# EAGLE design untitled (EAGLE 9.6.2)
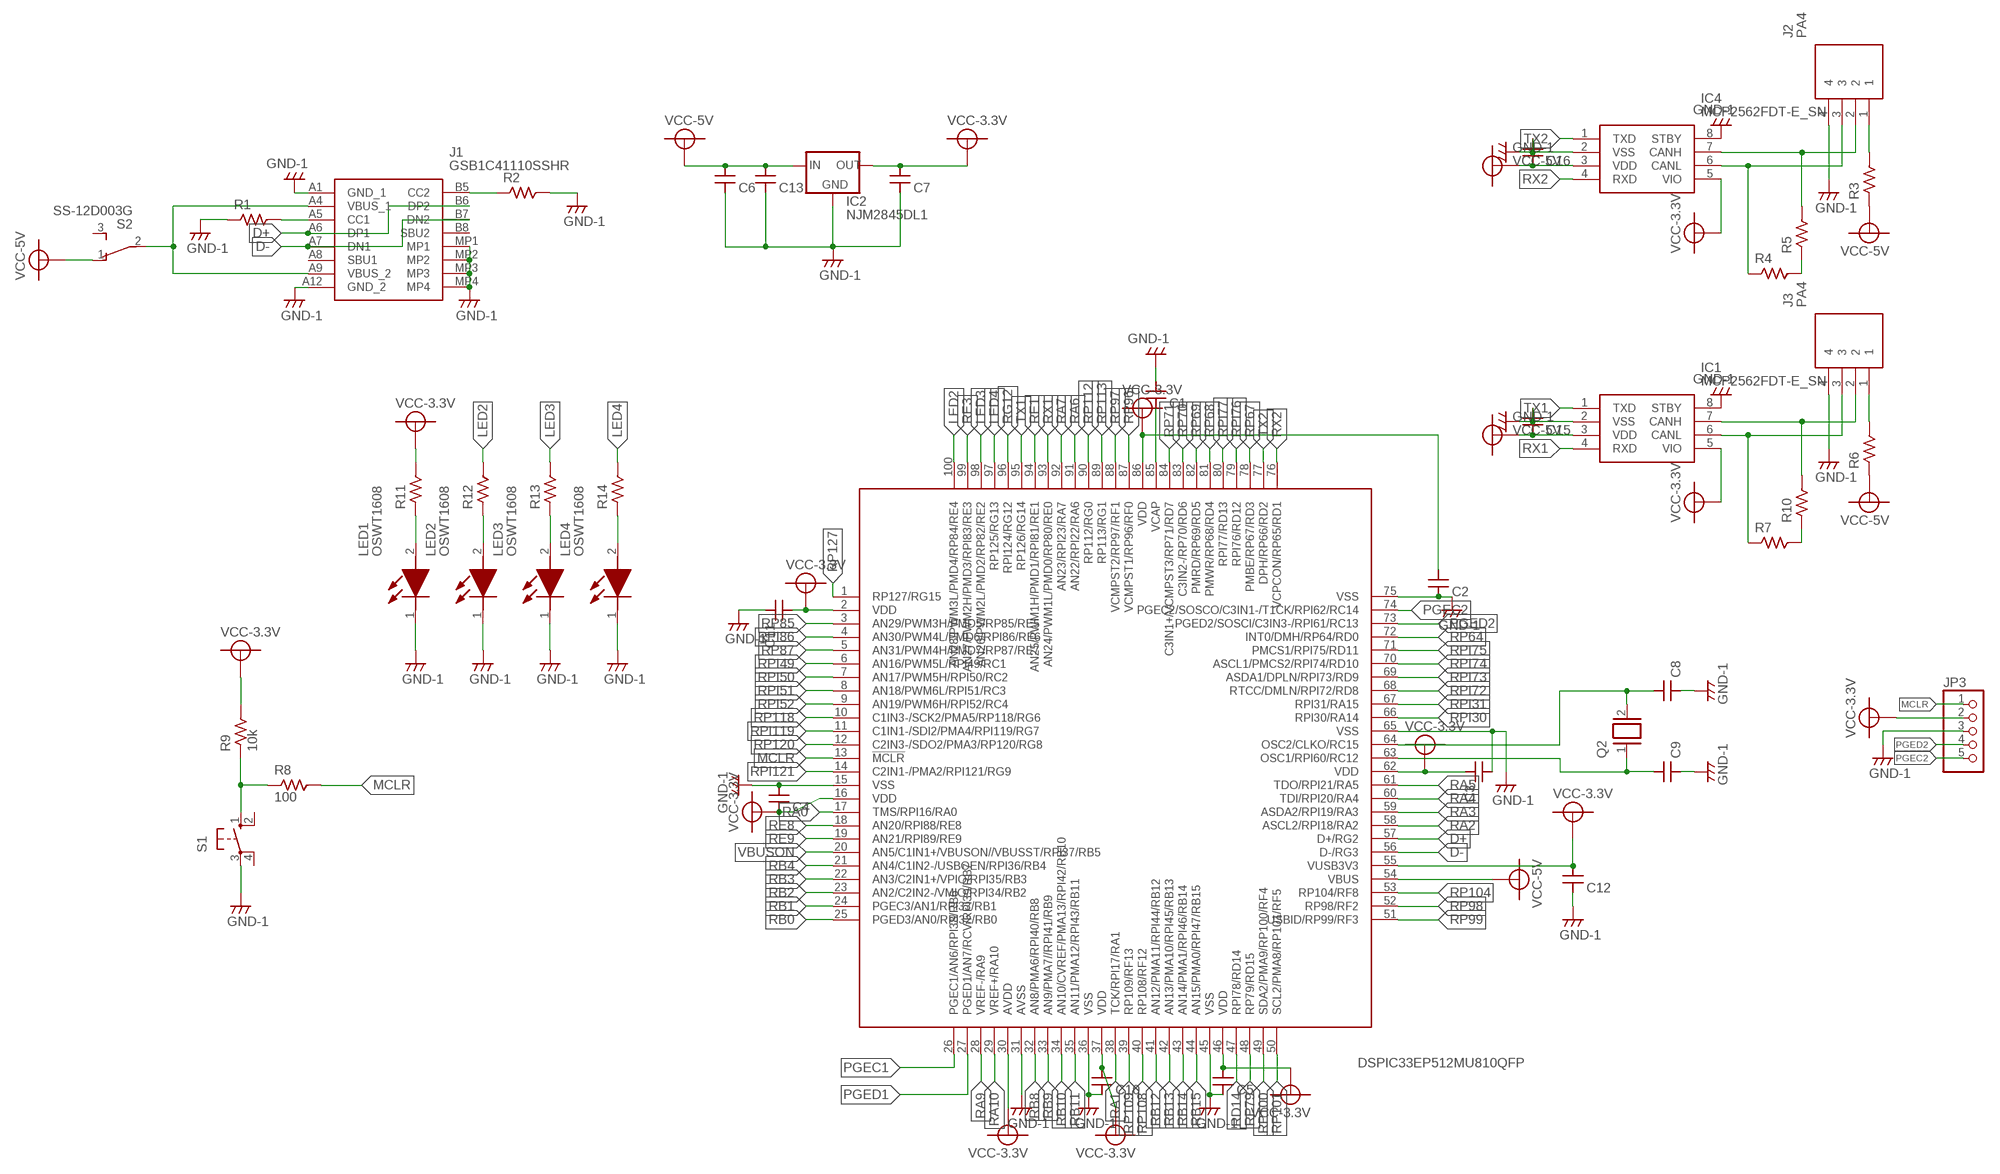
[diagram p0: schematic, sheet 1]

## Parts
C1  CC1068  [C1608]
C2  CC1068  [C1608]
C3  CC1068  [C1608]
C4  CC1068  [C1608]
C5  CC1068  [C1608]
C6  CC3216  [C3216]
C7  CC3216  [C3216]
C8  CC2.54  [C:1]
C9  CC2.54  [C:1]
C10  CC1068  [C1608]
C11  CC1068  [C1608]
C12  CC1068  [C1608]
C13  CC1068  [C1608]
C15  CC1068  [C1608]
C16  CC1068  [C1608]
IC1  MCP2562FDT-E_SN  [SOIC127P600X175-8N]
IC2  NJM2845DL1  [TO252]
IC3  DSPIC33EP512MU810QFP  [TQFP100_0.5]
IC4  MCP2562FDT-E_SN  [SOIC127P600X175-8N]
J1  GSB1C41110SSHR  [GSB1C41110SSHR]
J2  PA4  [PA4]
J3  PA4  [PA4]
JP3  PINHD-1X5/90  [1X05/90]
LED1  OSWT1608  [LEDC1608X70N]
LED2  OSWT1608  [LEDC1608X70N]
LED3  OSWT1608  [LEDC1608X70N]
LED4  OSWT1608  [LEDC1608X70N]
Q2  XTAL/S  [QS]
R1  R1/10W  [C1608]
R2  R1/10W  [C1608]
R3  R1/10W  [C1608]
R4  R1/10W  [C1608]
R5  R1/10W  [C1608]
R6  R1/10W  [C1608]
R7  R1/10W  [C1608]
R8  100  R1/10W  [C1608]
R9  10k  R1/10W  [C1608]
R10  R1/10W  [C1608]
R11  R1/10W  [C1608]
R12  R1/10W  [C1608]
R13  R1/10W  [C1608]
R14  R1/10W  [C1608]
S1  10-XX  [B3F-10XX]
S2  SS-12D003G  [SS-12D003G]

## Nets
+3.3V: C2.1 C3.2 C4.2 C5.1 C7.1 C10.1 C11.1 C12.1 IC1.5(VIO) IC2.3(OUT) IC3.2(VDD) IC3.16(VDD) IC3.30(AVDD) IC3.37(VDD) IC3.46(VDD) IC3.55(VUSB3V3) IC3.62(VDD) IC3.86(VDD) IC4.5(VIO) JP3.2 R9.2 R11.2 ; supply symbol labelled VCC-3.3V
+5V: C6.1 C13.1 C15.2 C16.2 IC1.3(VDD) IC2.1(IN) IC3.54(VBUS) IC4.3(VDD) R3.1 R6.1 S2.1(O) ; supply symbol labelled VCC-5V
D+: IC3.57(D+/RG2) J1.A6(DP1) J1.B6(DP2)
D-: IC3.56(D-/RG3) J1.A7(DN1) J1.B7(DN2)
GND: C1.1 C2.2 C3.1 C4.1 C5.2 C6.2 C7.2 C8.P$2 C9.P$2 C10.2 C11.2 C12.2 C13.2 C15.1 C16.1 IC1.2(VSS) IC1.8(STBY) IC2.2(GND) IC3.15(VSS) IC3.31(AVSS) IC3.36(VSS) IC3.45(VSS) IC3.65(VSS) IC3.75(VSS) IC4.2(VSS) IC4.8(STBY) J1.A1(GND_1) J1.A12(GND_2) J1.MP1 J1.MP2 J1.MP3 J1.MP4 J2.4 J3.4 JP3.3 LED1.1(K) LED2.1(K) LED3.1(K) LED4.1(K) R1.1 R2.2 S1.3(P) ; supply symbol labelled GND-1
LED2: IC3.100(AN28/PWM3L/PMD4/RP84/RE4) R12.2
LED3: IC3.98(AN26/PWM2L/PMD2/RP82/RE2) R13.2
LED4: IC3.97(RP125/RG13) R14.2
MCLR: IC3.13(!MCLR) JP3.1 R8.2
N$1: C9.P$1 IC3.63(OSC1/RPI60/RC12) Q2.1
N$2: C8.P$1 IC3.64(OSC2/CLKO/RC15) Q2.2
N$3: IC4.7(CANH) J2.2 R5.2
N$4: IC4.6(CANL) J2.3 R4.1
N$5: C1.2 IC3.85(VCAP)
N$6: J2.1 R3.2
N$7: R4.2 R5.1
N$8: J1.B5(CC2) R2.1
N$9: J1.A5(CC1) R1.2
N$10: R8.1 R9.1 S1.1(S)
N$11: J1.A4(VBUS_1) J1.A9(VBUS_2) S2.2(P)
N$12: IC1.7(CANH) J3.2 R10.2
N$13: IC1.6(CANL) J3.3 R7.1
N$14: J3.1 R6.2
N$15: R7.2 R10.1
N$16: LED1.2(A) R11.1
N$17: LED2.2(A) R12.1
N$18: LED3.2(A) R13.1
N$19: LED4.2(A) R14.1
PGEC1: IC3.26(PGEC1/AN6/RPI38/RB6)
PGEC2: IC3.74(PGEC2/SOSCO/C3IN1-/T1CK/RPI62/RC14) JP3.5
PGED1: IC3.27(PGED1/AN7/RCV/RPI39/RB7)
PGED2: IC3.73(PGED2/SOSCI/C3IN3-/RPI61/RC13) JP3.4
RA0: IC3.17(TMS/RPI16/RA0)
RA1: IC3.38(TCK/RPI17/RA1)
RA2: IC3.58(ASCL2/RPI18/RA2)
RA3: IC3.59(ASDA2/RPI19/RA3)
RA4: IC3.60(TDI/RPI20/RA4)
RA5: IC3.61(TDO/RPI21/RA5)
RA6: IC3.91(AN22/RPI22/RA6)
RA7: IC3.92(AN23/RPI23/RA7)
RA9: IC3.28(VREF-/RA9)
RA10: IC3.29(VREF+/RA10)
RB0: IC3.25(PGED3/AN0/RPI32/RB0)
RB1: IC3.24(PGEC3/AN1/RPI33/RB1)
RB2: IC3.23(AN2/C2IN2-/VMIO/RPI34/RB2)
RB3: IC3.22(AN3/C2IN1+/VPIO/RPI35/RB3)
RB4: IC3.21(AN4/C1IN2-/USBOEN/RPI36/RB4)
RB8: IC3.32(AN8/PMA6/RPI40/RB8)
RB9: IC3.33(AN9/PMA7//RPI41/RB9)
RB10: IC3.34(AN10/CVREF/PMA13/RPI42/RB10)
RB11: IC3.35(AN11/PMA12/RPI43/RB11)
RB12: IC3.41(AN12/PMA11/RPI44/RB12)
RB13: IC3.42(AN13/PMA10/RPI45/RB13)
RB14: IC3.43(AN14/PMA1/RPI46/RB14)
RB15: IC3.44(AN15/PMA0/RPI47/RB15)
RD14: IC3.47(RPI78/RD14)
RE1: IC3.94(AN25/PWM1H/PMD1/RPI81/RE1)
RE3: IC3.99(AN27/PWM2H/PMD3/RPI83/RE3)
RE8: IC3.18(AN20/RPI88/RE8)
RE9: IC3.19(AN21/RPI89/RE9)
RG12: IC3.96(RPI124/RG12)
RP64: IC3.72(INT0/DMH/RP64/RD0)
RP67: IC3.78(PMBE/RP67/RD3)
RP68: IC3.81(PMWR/RP68/RD4)
RP69: IC3.82(PMRD/RP69/RD5)
RP70: IC3.83(C3IN2-/RP70/RD6)
RP71: IC3.84(C3IN1+/VCMPST3/RP71/RD7)
RP79: IC3.48(RP79/RD15)
RP85: IC3.3(AN29/PWM3H/PMD5/RP85/RE5)
RP87: IC3.5(AN31/PWM4H/PMD7/RP87/RE7)
RP96: IC3.87(VCMPST1/RP96/RF0)
RP97: IC3.88(VCMPST2/RP97/RF1)
RP98: IC3.52(RP98/RF2)
RP99: IC3.51(USBID/RP99/RF3)
RP100: IC3.49(SDA2/PMA9/RP100/RF4)
RP101: IC3.50(SCL2/PMA8/RP101/RF5)
RP104: IC3.53(RP104/RF8)
RP108: IC3.40(RP108/RF12)
RP109: IC3.39(RP109/RF13)
RP112: IC3.90(RP112/RG0)
RP113: IC3.89(RP113/RG1)
RP118: IC3.10(C1IN3-/SCK2/PMA5/RP118/RG6)
RP120: IC3.12(C2IN3-/SDO2/PMA3/RP120/RG8)
RP127: IC3.1(RP127/RG15)
RPI30: IC3.66(RPI30/RA14)
RPI31: IC3.67(RPI31/RA15)
RPI49: IC3.6(AN16/PWM5L/RPI49/RC1)
RPI50: IC3.7(AN17/PWM5H/RPI50/RC2)
RPI51: IC3.8(AN18/PWM6L/RPI51/RC3)
RPI52: IC3.9(AN19/PWM6H/RPI52/RC4)
RPI72: IC3.68(RTCC/DMLN/RPI72/RD8)
RPI73: IC3.69(ASDA1/DPLN/RPI73/RD9)
RPI74: IC3.70(ASCL1/PMCS2/RPI74/RD10)
RPI75: IC3.71(PMCS1/RPI75/RD11)
RPI76: IC3.79(RPI76/RD12)
RPI77: IC3.80(RPI77/RD13)
RPI86: IC3.4(AN30/PWM4L/PMD6/RPI86/RE6)
RPI119: IC3.11(C1IN1-/SDI2/PMA4/RPI119/RG7)
RPI121: IC3.14(C2IN1-/PMA2/RPI121/RG9)
RX1: IC1.4(RXD) IC3.93(AN24/PWM1L/PMD0/RP80/RE0)
RX2: IC3.76(VCPCON/RP65/RD1) IC4.4(RXD)
TX1: IC1.1(TXD) IC3.95(RP126/RG14)
TX2: IC3.77(DPH/RP66/RD2) IC4.1(TXD)
VBUSON: IC3.20(AN5/C1IN1+/VBUSON//VBUSST/RPI37/RB5)
Unconnected: J1.A8(SBU1) J1.B8(SBU2) S1.2(S1) S1.4(P1) S2.3(S)

## Library data of the parts
C1-C13 C15 C16 = Robocon-RLC:CC: Ceramic Condensare
IC1 IC4 = MCP2562FDT-E_SN:MCP2562FDT-E_SN: CAN 8Mbps Normal/Standby 3.3V/5V Automotive 8-Pin SOIC N T/R Source: Datasheet <https://ww1.microchip.com/downloads/en/DeviceDoc/20005284A.pdf>; ARROW_PART_NUMBER: MCP2562FDT-E/SN; ARROW_PRICE-STOCK: https://www.arrow.com/en/products/mcp2562fdt-esn/microchip-technology?region=nac; DESCRIPTION: CAN 8Mbps Normal/Standby 3.3V/5V Automotive 8-Pin SOIC N T/R; HEIGHT: 1.75mm; MANUFACTURER_NAME: Microchip; MANUFACTURER_PART_NUMBER: MCP2562FDT-E/SN; MOUSER_PART_NUMBER: 579-MCP2562FDT-E/SN; MOUSER_PRICE-STOCK: https://www.mouser.co.uk/ProductDetail/Microchip-Technology/MCP2562FDT-E-SN?qs=YlpJWyuQ3PNwRkBGVHsNkA%3D%3D
IC2 = Robocon-Regulator:NJM2845DL1
IC3 = Robocon-PICMicroController:DSPIC33EP512MU810
J1 = GSB1C41110SSHR:GSB1C41110SSHR: USB2.0, Type C, Top mount, Center Height 1.63mm, Single Row Surface Mount Source: Datasheet <https://cdn.amphenol-cs.com/media/wysiwyg/files/drawing/gsb1c41x10sshr-ax1.pdf>; DESCRIPTION: USB2.0, Type C, Top mount, Center Height 1.63mm, Single Row Surface Mount; HEIGHT: 3.41mm; MANUFACTURER_NAME: Amphenol Communications Solutions; MANUFACTURER_PART_NUMBER: GSB1C41110SSHR
J2 J3 = Robocon-Connector:PA4: CONN HEADER VERT 4POS 2MM Source: Datasheet <http://www.jst-mfg.com/product/pdf/eng/ePA-F.pdf>; ARROW_PART_NUMBER: B04B-PASK(LF)(SN); ARROW_PRICE-STOCK: https://www.arrow.com/en/products/b04b-pask-lf-sn/jst-manufacturing?region=europe; DESCRIPTION: CONN HEADER VERT 4POS 2MM; HEIGHT: 7.7mm; MANUFACTURER_NAME: JST (JAPAN SOLDERLESS TERMINALS); MANUFACTURER_PART_NUMBER: B04B-PASK(LF)(SN)
JP3 = Robocon-Pin_Header:PINHD-1X5: PIN HEADER
LED1-LED4 = OSWT1608:OSWT1608: White chip LED [1608] 1.6 x 0.8 x 0.6mm SMD LED Source: Datasheet <https://akizukidenshi.com/download/ds/optosupply/OSXX1608C1A_ver_a_10.pdf>; DESCRIPTION: White chip LED [1608] 1.6 x 0.8 x 0.6mm SMD LED; HEIGHT: 0.7mm; MANUFACTURER_NAME: OptoSupply; MANUFACTURER_PART_NUMBER: OSWT1608
Q2 = Robocon-Other:XTAL/S: CRYSTAL
R1-R14 = Robocon-RLC:R: Resistor
S1 = Robocon-Switches:10-XX: OMRON SWITCH; MPN: B3F-1000; OC_FARNELL: 176432; OC_NEWARK: 36M3542
S2 = Robocon-Switches:SS-12D003G

## Board
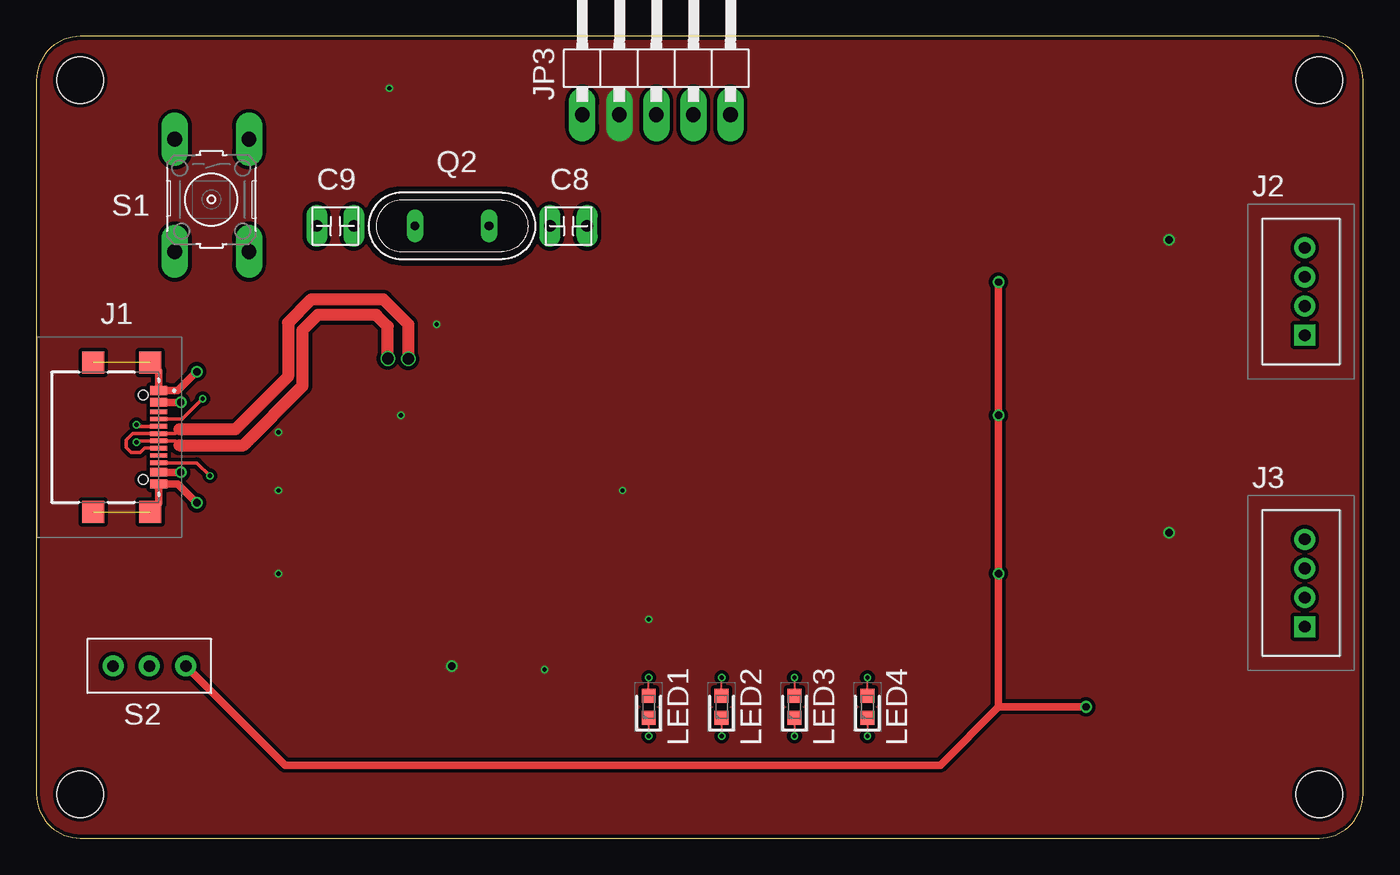
[diagram p1: board, top side]
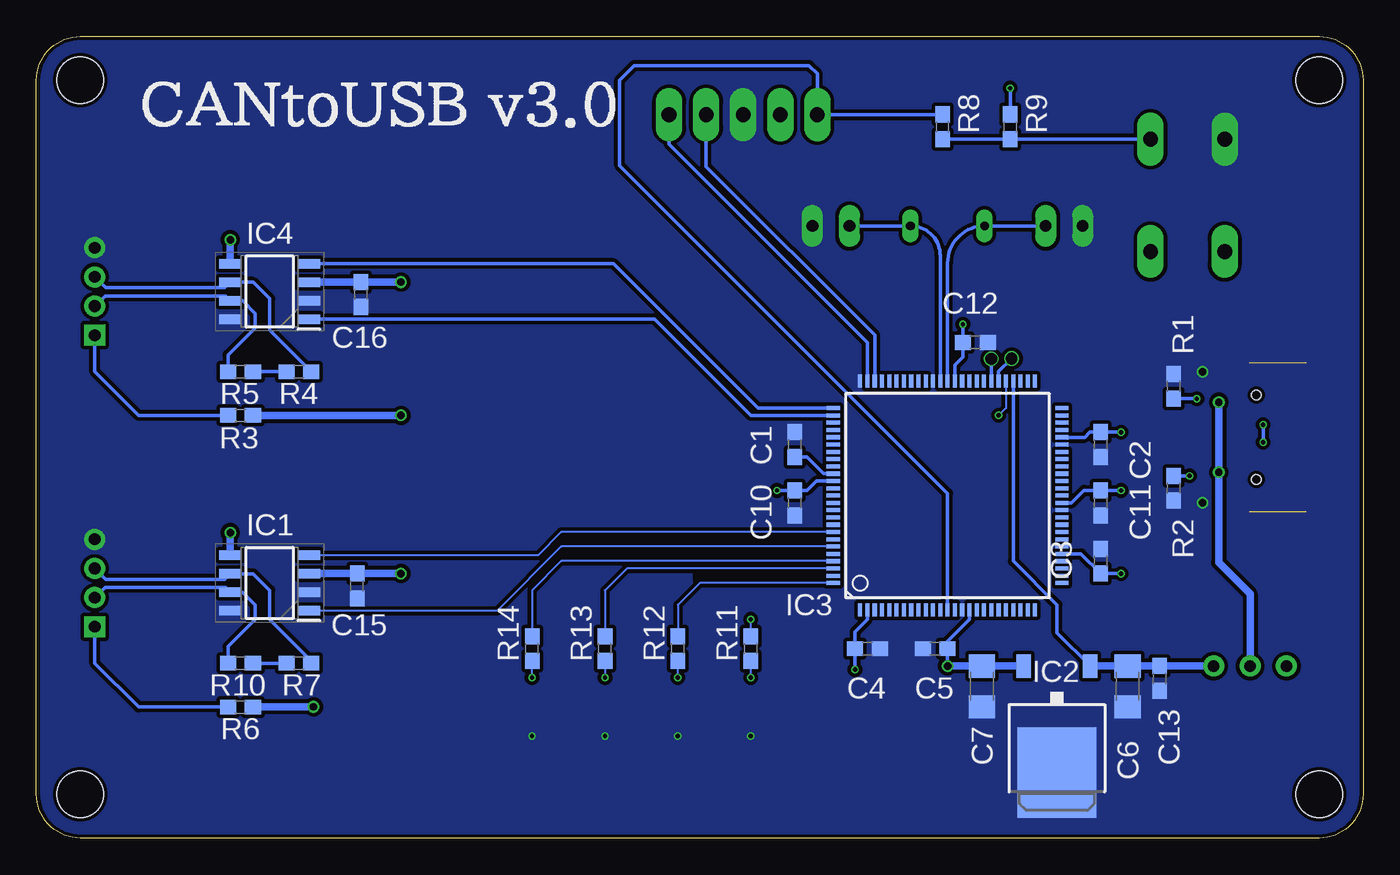
[diagram p2: board, bottom side, seen from below]

Size 91 x 55 mm. Coordinates in mm from the lower left corner, seen from the top.
Outline: 88,55 3,55 arc90 0,52 0,3 arc90 3,0 88,0 arc90 91,3 91,52 arc90 88,55
Copper layers (1*16): Top 0.035mm / dielectric 1.6mm / Bottom 0.035mm
Design rules "JLC": minimum track width 5mil, minimum drill 0.3mm, track to track 5mil, track to pad 5mil, pad to pad 5mil, via to via 5mil, smd to smd 5mil, copper to edge 0.2mm, drill to drill 6mil, minimum pad ring 10mil, minimum via ring 3mil, stop-mask expansion 4mil, vias tented up to drill 0mil, thermal gap 10mil
Holes 3.2 mm at 3,3 3,52 88,52 88,3
tRestrict: area 22.7,39.6 to 34.3,44.4
bRestrict: area 45.1,17.7 to 45.6,18.2

### Footprints (pad centres in the part's own frame; a part is rotated, then mirrored left to right if it is on the bottom)
C1608 = smd 1.1 x 1: 1 -0.85,0; 2 0.85,0
C3216 = smd 1.6 x 1.8: 1 -1.4,0; 2 1.4,0
C:1 = drill 0.8 long: P$1 -1.27,0; P$2 1.27,0
SOIC127P600X175-8N = smd 1.5 x 0.65: 1 -2.7,1.905; 2 -2.7,0.635; 3 -2.7,-0.635; 4 -2.7,-1.905; 5 2.7,-1.905; 6 2.7,-0.635; 7 2.7,0.635; 8 2.7,1.905
TO252 = smd 1 x 1.6: 1 -2.28,-4.8; 3 2.28,-4.8 | smd 5.4 x 6.2: 2 0,2.5
TQFP100_0.5 = smd 0.9 x 0.28: 1 -7.85,6; 2 -7.85,5.5; 3 -7.85,5; 4 -7.85,4.5; 5 -7.85,4; 6 -7.85,3.5; 7 -7.85,3; 8 -7.85,2.5; 9 -7.85,2; 10 -7.85,1.5; 11 -7.85,1; 12 -7.85,0.5; 13 -7.85,0; 14 -7.85,-0.5; 15 -7.85,-1; 16 -7.85,-1.5; 17 -7.85,-2; 18 -7.85,-2.5; 19 -7.85,-3; 20 -7.85,-3.5; 21 -7.85,-4; 22 -7.85,-4.5; 23 -7.85,-5; 24 -7.85,-5.5; 25 -7.85,-6; 51 7.85,-6; 52 7.85,-5.5; 53 7.85,-5; 54 7.85,-4.5; 55 7.85,-4; 56 7.85,-3.5; 57 7.85,-3; 58 7.85,-2.5; 59 7.85,-2; 60 7.85,-1.5; 61 7.85,-1; 62 7.85,-0.5; 63 7.85,0; 64 7.85,0.5; 65 7.85,1; 66 7.85,1.5; 67 7.85,2; 68 7.85,2.5; 69 7.85,3; 70 7.85,3.5; 71 7.85,4; 72 7.85,4.5; 73 7.85,5; 74 7.85,5.5; 75 7.85,6 | smd 0.28 x 0.9: 26 -6,-7.85; 27 -5.5,-7.85; 28 -5,-7.85; 29 -4.5,-7.85; 30 -4,-7.85; 31 -3.5,-7.85; 32 -3,-7.85; 33 -2.5,-7.85; 34 -2,-7.85; 35 -1.5,-7.85; 36 -1,-7.85; 37 -0.5,-7.85; 38 0,-7.85; 39 0.5,-7.85; 40 1,-7.85; 41 1.5,-7.85; 42 2,-7.85; 43 2.5,-7.85; 44 3,-7.85; 45 3.5,-7.85; 46 4,-7.85; 47 4.5,-7.85; 48 5,-7.85; 49 5.5,-7.85; 50 6,-7.85; 76 6,7.85; 77 5.5,7.85; 78 5,7.85; 79 4.5,7.85; 80 4,7.85; 81 3.5,7.85; 82 3,7.85; 83 2.5,7.85; 84 2,7.85; 85 1.5,7.85; 86 1,7.85; 87 0.5,7.85; 88 0,7.85; 89 -0.5,7.85; 90 -1,7.85; 91 -1.5,7.85; 92 -2,7.85; 93 -2.5,7.85; 94 -3,7.85; 95 -3.5,7.85; 96 -4,7.85; 97 -4.5,7.85; 98 -5,7.85; 99 -5.5,7.85; 100 -6,7.85
GSB1C41110SSHR = smd 0.6 x 1.15: A1 -3.2,3.39; A4 -2.4,3.39; A9 2.4,3.39; A12 3.2,3.39 | smd 0.3 x 1.15: A5 -1.25,3.39; A6 -0.25,3.39; A7 0.25,3.39; A8 1.25,3.39; B5 1.75,3.39; B6 0.75,3.39; B7 -0.75,3.39; B8 -1.75,3.39 | smd 1.5 x 1.5: MP1 -5.12,2.815; MP2 5.12,2.815; MP3 -5.12,-1.115; MP4 5.12,-1.115 | hole 0.65: -2.89,2.315; 2.89,2.315
PA4 = drill 0.8 pad 1.3 square: 1 0,0 | drill 0.8 pad 1.3: 2 -2,0; 3 -4,0; 4 -6,0
1X05/90 = drill 1.016 long: 1 -5.08,-3.81; 2 -2.54,-3.81; 3 0,-3.81; 4 2.54,-3.81; 5 5.08,-3.81
LEDC1608X70N = smd 0.95 x 0.95: 1 -0.75,0; 2 0.75,0
QS = drill 0.61 long: 1 -2.54,0; 2 2.54,0
B3F-10XX = drill 1.016 long: 1 -2.553,2.578; 2 5.156,2.578; 3 -2.553,-2.515; 4 5.156,-2.515
SS-12D003G = drill 0.8: 1 -2.5,0; 2 0,0; 3 2.5,0

### Placement (x,y rotation side)
C1  39,27 270 bottom
C2  18,27 270 bottom
C3  18,19 270 bottom
C4  34,13 180 bottom
C5  29.35,13 180 bottom
C6  16.15,10.4 270 bottom
C7  26.15,10.4 270 bottom
C8  36.5,42 0 top
C9  20.5,42 180 top
C10  39,23 270 bottom
C11  18,23 270 bottom
C12  26.6,34 0 bottom
C13  13.95,10.95 270 bottom
C15  69,17.3 90 bottom
C16  68.75,37.3 90 bottom
IC1  75,17.5 180 bottom
IC2  21,7 180 bottom
IC3  28.5,23.5 90 bottom
IC4  75,37.5 180 bottom
J1  5,27.5 270 top
J2  87,34.5 270 top
J3  87,14.5 270 top
JP3  42.52,53.44 0 top
LED1  42,9 90 top
LED2  47,9 90 top
LED3  52,9 90 top
LED4  57,9 90 top
Q2  28.5,42 0 top
R1  13,31 270 bottom
R2  13,24 270 bottom
R3  77,29 180 bottom
R4  73,32 180 bottom
R5  77,32 180 bottom
R6  77,9 180 bottom
R7  73,12 180 bottom
R8  28.85,48.8 90 bottom
R9  24.2,48.8 90 bottom
R10  77,12 180 bottom
R11  42,13 90 bottom
R12  47,13 90 bottom
R13  52,13 90 bottom
R14  57,13 90 bottom
S1  12,45.4 270 top
S2  7.75,11.8 180 top

### Tracks (layer width: path | path; a pad name or v marks a point on that pad's centre or on a via)
+3.3V  (via drill 0.3 pad 0.5, 0.5 pad 0.8)
  Bottom 0.152: R11.2 v42,15 | IC3.55 24.5,29.5 v25,29
  Bottom 0.254: IC3.62 28,32.45 27.45,33 C12.1 v27.45,35.25 | IC3.46 19.1,27.5 18.75,27.85 C2.1 v16.6,27.85 | IC3.16 27,15 28.5,13.5 C5.1 v28.5,11.8 | IC3.2 34,15 34.85,14.15 C4.2 v34.85,11.55 | IC3.86 37.5,24.5 38.15,23.85 C10.1 v40.2,23.85 | v16.6,23.85 C11.1 19.15,23.85 20,23 IC3.37 | R9.2 v24.2,51.45 | IC3.30 19.35,19.5 C3.2 v16.6,18.15
  Bottom 0.508: IC4.5 v77.7,41.05 | IC1.5 v77.7,20.95 | IC2.3 C7.1 v28.5,11.8
  pour Top (isolate 0.254, no thermals): 0,0 91,0 91,55 0,55
+5V  (via drill 0.5 pad 0.8)
  Top 0.508: S2.1 17.05,5 62,5 66,9 | v72,9 66,9 | 66,9 v66,18.15 v66,29 v66,38.15
  Bottom 0.254: IC3.54 24,19 21,16 21,14.08 IC2.1
  Bottom 0.508: v66,18.15 C15.2 72.28,18.15 IC1.3 | v66,38.15 C16.2 72.28,38.15 IC4.3 | S2.1 C13.1 C6.1 IC2.1 | v72,9 R6.1 | R3.1 v66,29
D+  (via drill 0.8 pad 1)
  Top 0.254: J1.B6 7.41,26.75 7.11,26.45 6.5,26.45 6.15,26.8 6.15,27.3 6.6,27.75 J1.A6 9.5,27.75 9.8,28.05
  Top 0.813: 9.8,28.05 13.65,28.05 17.25,31.65 17.25,35.35 18.85,36.95 23.8,36.95 25.5,35.25 v25.5,32.87
  Bottom 0.254: IC3.57 v25.5,32.87
D-  (via drill 0.3 pad 0.5, 0.8 pad 1)
  Top 0.254: J1.B7 6.95,28.25 v6.85,28.35 | v6.85,27.15 6.95,27.25 J1.A7 9.5,27.25 9.8,26.95
  Top 0.813: 9.8,26.95 14.2,26.95 18.25,31 18.25,34.85 19.3,35.9 23.3,35.9 24.1,35.1 v24.1,32.9
  Bottom 0.254: v6.85,28.35 v6.85,27.15 | IC3.56 25,32 v24.1,32.9
GND  (via drill 0.3 pad 0.5, 0.5 pad 0.8)  (2 unrouted)
  Top 0.152: LED1.1 v42,7 | LED2.1 v47,7 | LED3.1 v52,7 | LED4.1 v57,7
  Top 0.508: J1.MP2 8.39,22.95 J1.A12 9.7,24.3 v11,23 | J1.MP1 8.39,32.05 J1.A1 9.7,30.7 v11,32
  pour Bottom (isolate 0.254, no thermals): 0,55 0,0 91,0 91,55
LED2
  Bottom 0.152: IC3.100 45.5,17.5 47,16 R12.2
LED3
  Bottom 0.152: IC3.98 50.5,18.5 52,17 R13.2
LED4
  Bottom 0.152: IC3.97 55,19 57,17 R14.2
MCLR
  Bottom 0.254: IC3.13 28.5,23.65 51,46.15 51,52 50,53 38,53 37.44,52.44 JP3.1 28.87,49.63 R8.2
N$1
  Bottom 0.254: IC3.63 28.5,39.46 arc90 Q2.1 C9.P$1
N$2
  Bottom 0.254: IC3.64 29,39.96 arc-90 Q2.2 C8.P$1
N$3
  Bottom 0.254: J2.2 86.3,37.2 78.03,37.2 IC4.7 76.86,36.87 76,36 76,35 77.85,33.15 R5.2
N$4
  Bottom 0.254: J2.3 86.26,37.76 78.08,37.76 IC4.6 76.14,38.13 75,37 75,34.85 R4.1
N$5
  Bottom 0.254: IC3.85 37,25 38.15,26.15 C1.2
N$6
  Bottom 0.254: R3.2 84,29 87,32 J2.1
N$7
  Bottom 0.254: R5.1 R4.2
N$8  (via drill 0.3 pad 0.5)
  Top 0.254: J1.B5 11,25.75 v11.9,24.85
  Bottom 0.254: v11.9,24.85 R2.1
N$9  (via drill 0.3 pad 0.5)
  Top 0.254: J1.A5 10,28.75 v11.4,30.15
  Bottom 0.254: v11.4,30.15 R1.2
N$10
  Bottom 0.254: R8.1 R9.1 S1.1
N$11  (via drill 0.5 pad 0.8)
  Top 0.508: J1.A9 v9.9,25.1 | J1.A4 v9.9,29.9
  Bottom 0.508: v9.9,29.9 v9.9,25.1 9.9,18.9 7.75,16.75 S2.2
N$12
  Bottom 0.254: J3.2 86.3,17.2 86,17.2 78.03,17.2 IC1.7 76.86,16.86 76,16 76,15 77.85,13.15 R10.2
N$13
  Bottom 0.254: J3.3 86.26,17.76 78.08,17.76 IC1.6 76.14,18.14 75,17 75,15 72.15,12.15 R7.1
N$14
  Bottom 0.254: R6.2 84,9 87,12 J3.1
N$15
  Bottom 0.254: R10.1 R7.2
N$16  (via drill 0.3 pad 0.5)
  Top 0.152: LED1.2 v42,11
  Bottom 0.152: v42,11 R11.1
N$17  (via drill 0.3 pad 0.5)
  Top 0.152: LED2.2 v47,11
  Bottom 0.152: v47,11 R12.1
N$18  (via drill 0.3 pad 0.5)
  Top 0.152: v52,11 LED3.2
  Bottom 0.152: R13.1 v52,11
N$19  (via drill 0.3 pad 0.5)
  Top 0.152: LED4.2 v57,11
  Bottom 0.152: v57,11 R14.1
PGEC2
  Bottom 0.254: IC3.74 34,34 47.6,47.6 JP3.5
PGED2
  Bottom 0.254: IC3.73 33.5,34.5 45.06,46.06 JP3.4
RX1
  Bottom 0.152: IC3.93 55,21 56.59,19.41 IC1.4
RX2
  Bottom 0.254: IC3.76 41.5,29.5 51.41,39.41 IC4.4
TX1
  Bottom 0.152: IC3.95 55,20 59.41,15.6 IC1.1
TX2
  Bottom 0.254: IC3.77 42,29 48.59,35.59 IC4.1